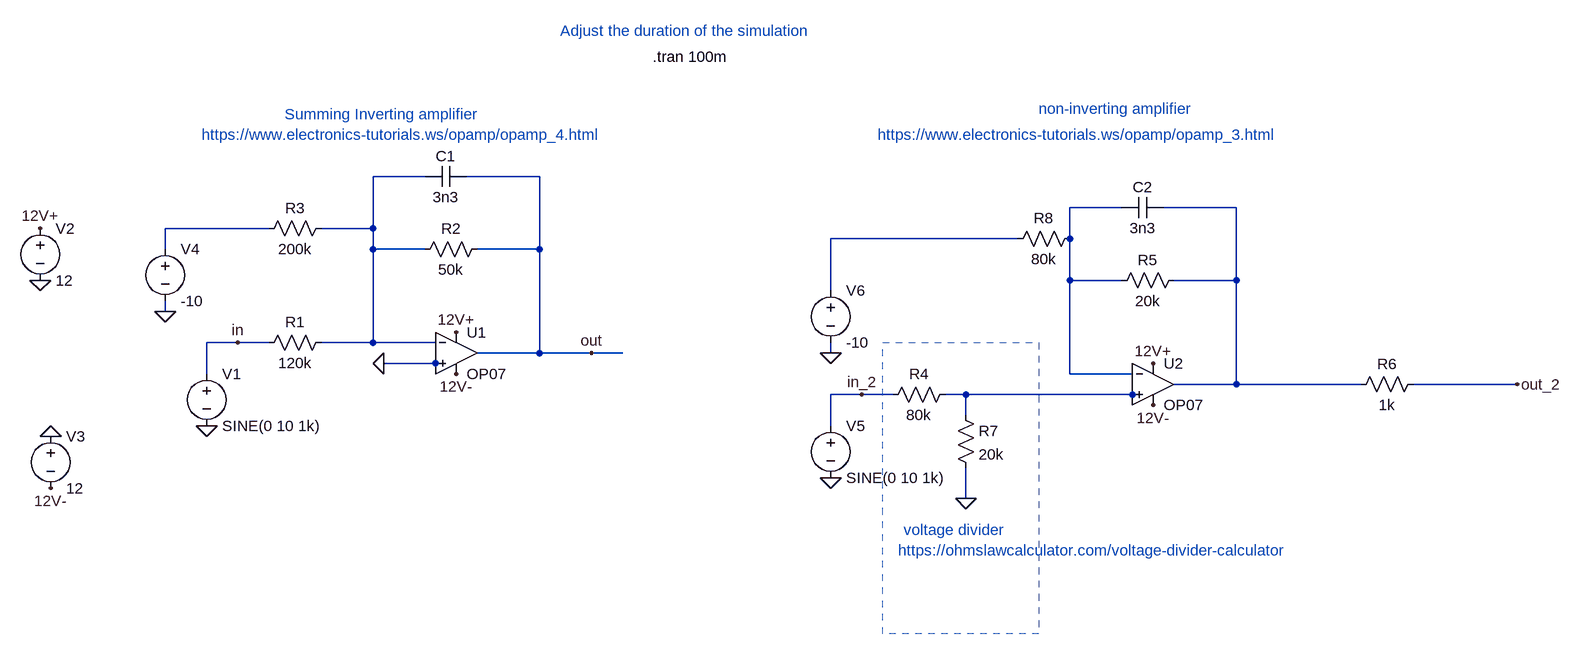
[diagram p0: schematic op-amp_tutorial.asc]
op-amp_tutorial.asc, the LTspice schematic file:
Version 4
SHEET 1 2712 680
WIRE 272 -48 192 -48
WIRE 448 -48 336 -48
WIRE 1344 0 1264 0
WIRE 1520 0 1408 0
WIRE 32 32 -128 32
WIRE 192 32 192 -48
WIRE 192 32 112 32
WIRE 1184 48 896 48
WIRE 1264 48 1264 0
WIRE -128 64 -128 32
WIRE 192 64 192 32
WIRE 272 64 192 64
WIRE 448 64 448 -48
WIRE 448 64 352 64
WIRE 1264 112 1264 48
WIRE 1344 112 1264 112
WIRE 1520 112 1520 0
WIRE 1520 112 1424 112
WIRE 896 128 896 48
WIRE -128 160 -128 144
WIRE -16 208 -64 208
WIRE 32 208 -16 208
WIRE 192 208 192 64
WIRE 192 208 112 208
WIRE 288 208 192 208
WIRE 448 224 448 64
WIRE 448 224 352 224
WIRE 528 224 448 224
WIRE 576 224 528 224
WIRE 896 224 896 208
WIRE 288 240 208 240
WIRE 304 240 288 240
WIRE -64 256 -64 208
WIRE 1264 256 1264 112
WIRE 1360 256 1264 256
WIRE 1520 272 1520 112
WIRE 1520 272 1424 272
WIRE 1712 272 1520 272
WIRE 1952 272 1792 272
WIRE 944 288 896 288
WIRE 992 288 944 288
WIRE 1104 288 1072 288
WIRE 1360 288 1104 288
WIRE 1376 288 1360 288
WIRE 1104 320 1104 288
WIRE 896 336 896 288
WIRE 1104 448 1104 400
FLAG -320 112 0
FLAG -320 32 12V+
FLAG -304 352 0
FLAG -304 432 12V-
FLAG 208 240 0
FLAG 320 256 12V-
FLAG 320 192 12V+
FLAG -64 336 0
FLAG -128 160 0
FLAG 528 224 out
FLAG -16 208 in
FLAG 1392 304 12V-
FLAG 1392 240 12V+
FLAG 896 416 0
FLAG 896 224 0
FLAG 1952 272 out_2
FLAG 944 288 in_2
FLAG 1104 448 0
SYMBOL voltage -64 240 R0
WINDOW 123 0 0 Left 0
WINDOW 39 0 0 Left 0
SYMATTR InstName V1
SYMATTR Value SINE(0 10 1k)
SYMBOL voltage -320 16 R0
WINDOW 123 0 0 Left 0
WINDOW 39 0 0 Left 0
SYMATTR InstName V2
SYMATTR Value 12
SYMBOL voltage -304 336 R0
WINDOW 123 0 0 Left 0
WINDOW 39 0 0 Left 0
SYMATTR InstName V3
SYMATTR Value 12
SYMBOL OpAmps\\OP07 320 160 R0
SYMATTR InstName U1
SYMBOL res 128 192 R90
WINDOW 0 0 56 VBottom 2
WINDOW 3 32 56 VTop 2
SYMATTR InstName R1
SYMATTR Value 120k
SYMBOL res 368 48 R90
WINDOW 0 0 56 VBottom 2
WINDOW 3 32 56 VTop 2
SYMATTR InstName R2
SYMATTR Value 50k
SYMBOL cap 336 -64 R90
WINDOW 0 0 32 VBottom 2
WINDOW 3 32 32 VTop 2
SYMATTR InstName C1
SYMATTR Value 3n3
SYMBOL res 128 16 R90
WINDOW 0 0 56 VBottom 2
WINDOW 3 32 56 VTop 2
SYMATTR InstName R3
SYMATTR Value 200k
SYMBOL voltage -128 48 R0
WINDOW 123 0 0 Left 0
WINDOW 39 0 0 Left 0
SYMATTR InstName V4
SYMATTR Value -10
SYMBOL voltage 896 320 R0
WINDOW 123 0 0 Left 0
WINDOW 39 0 0 Left 0
SYMATTR InstName V5
SYMATTR Value SINE(0 10 1k)
SYMBOL OpAmps\\OP07 1392 208 R0
SYMATTR InstName U2
SYMBOL res 1088 272 R90
WINDOW 0 0 56 VBottom 2
WINDOW 3 32 56 VTop 2
SYMATTR InstName R4
SYMATTR Value 80k
SYMBOL res 1440 96 R90
WINDOW 0 0 56 VBottom 2
WINDOW 3 32 56 VTop 2
SYMATTR InstName R5
SYMATTR Value 20k
SYMBOL cap 1408 -16 R90
WINDOW 0 0 32 VBottom 2
WINDOW 3 32 32 VTop 2
SYMATTR InstName C2
SYMATTR Value 3n3
SYMBOL voltage 896 112 R0
WINDOW 123 0 0 Left 0
WINDOW 39 0 0 Left 0
SYMATTR InstName V6
SYMATTR Value -10
SYMBOL res 1088 304 R0
SYMATTR InstName R7
SYMATTR Value 20k
SYMBOL res 1280 32 R90
WINDOW 0 0 56 VBottom 2
WINDOW 3 32 56 VTop 2
SYMATTR InstName R8
SYMATTR Value 80k
SYMBOL res 1808 256 R90
WINDOW 0 0 56 VBottom 2
WINDOW 3 32 56 VTop 2
SYMATTR InstName R6
SYMATTR Value 1k
TEXT 622 -232 Left 2 !.tran 100m
TEXT 480 -272 Left 2 ;Adjust the duration of the simulation
TEXT 56 -144 Left 2 ;Summing Inverting amplifier
TEXT 1216 -152 Left 2 ;non-inverting amplifier
TEXT -72 -112 Left 2 ;https://www.electronics-tutorials.ws/opamp/opamp_4.html
TEXT 968 -112 Left 2 ;https://www.electronics-tutorials.ws/opamp/opamp_3.html
TEXT 1008 496 Left 2 ;voltage divider
TEXT 1000 528 Left 2 ;https://ohmslawcalculator.com/voltage-divider-calculator
RECTANGLE Normal 1216 656 976 208 2

The netlist it stands for:
* op-amp_tutorial.asc
V1 in 0 SINE(0 10 1k)
V2 12V+ 0 12
V3 0 12V- 12
XU1 0 N001 12V+ 12V- out LT1001  ; OP07, pins In+ In- V+ V- OUT
R1 N001 in 120k
R2 out N001 50k
C1 out N001 3n3
R3 N001 N004 200k
V4 N004 0 -10
V5 in_2 0 SINE(0 10 1k)
XU2 N006 N002 12V+ 12V- N003 LT1001  ; OP07, pins In+ In- V+ V- OUT
R4 N006 in_2 80k
R5 N003 N002 20k
C2 N003 N002 3n3
V6 N005 0 -10
R7 N006 0 20k
R8 N002 N005 80k
R6 out_2 N003 1k
.tran 100m
* Adjust the duration of the simulation
* Summing Inverting amplifier
* non-inverting amplifier
* https://www.electronics-tutorials.ws/opamp/opamp_4.html
* https://www.electronics-tutorials.ws/opamp/opamp_3.html
* voltage divider
* https://ohmslawcalculator.com/voltage-divider-calculator
.lib LTC.lib
.backanno
.end